# EAGLE design Q_Control (EAGLE 6.3)
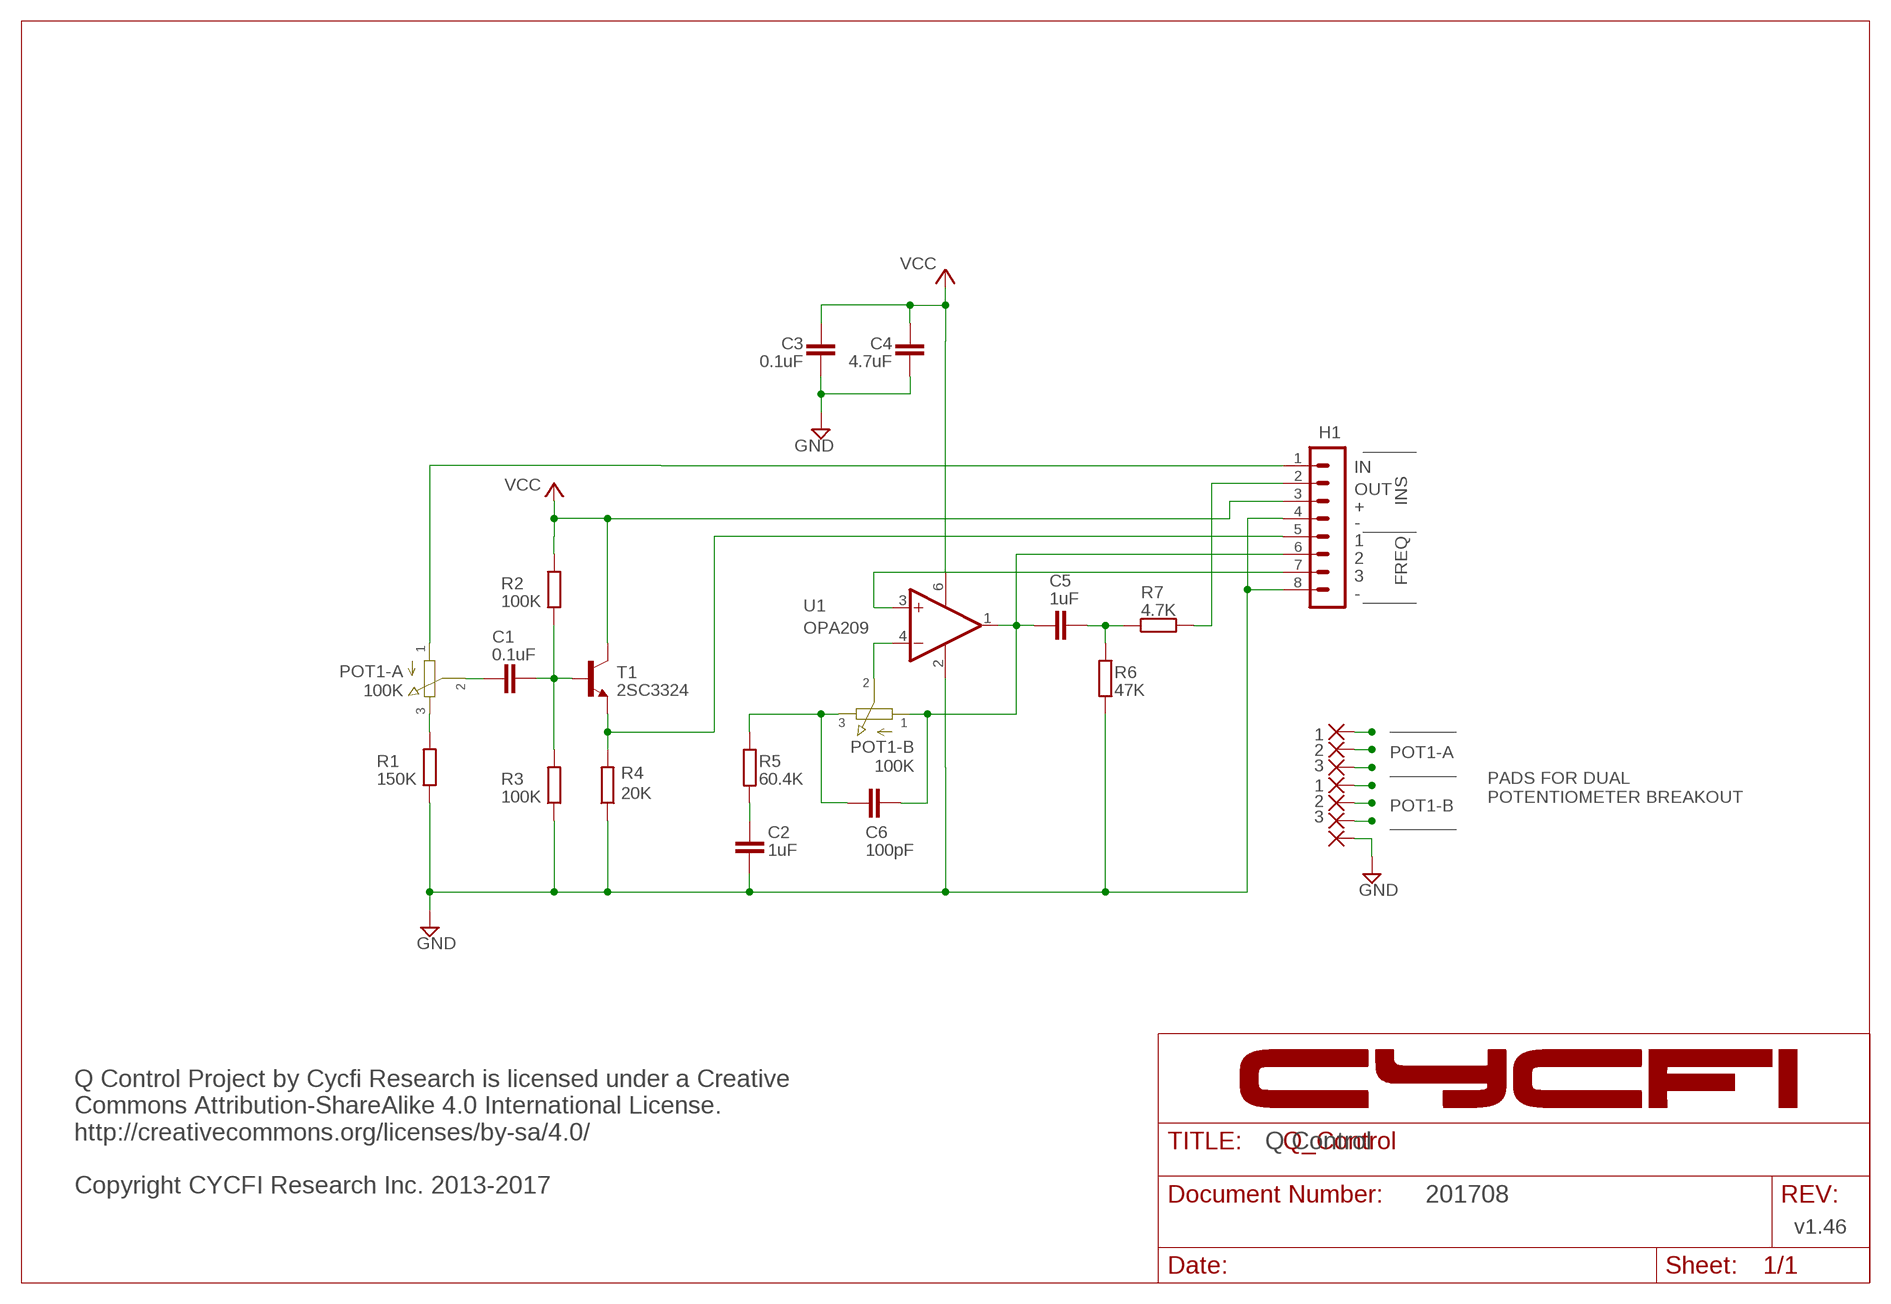
[diagram p0: schematic, sheet 1]

## Parts
C1  0.1uF  C-EUC0603  [C0603]
C2  1uF  C-EUC0805  [C0805]
C3  0.1uF  C-EUC0603  [C0603]
C4  4.7uF  C-EUC0603  [C0603]
C5  1uF  C-EUC0805  [C0805]
C6  100pF  C-EUC0805  [C0805]
H1  MA08-1  [MA08-1]
PAD1  SMD2  [SMD1,27-2,54]
PAD2  SMD2  [SMD1,27-2,54]
PAD3  SMD2  [SMD1,27-2,54]
PAD4  SMD2  [SMD1,27-2,54]
PAD5  SMD2  [SMD1,27-2,54]
PAD6  SMD2  [SMD1,27-2,54]
PAD7  SMD2  [SMD1,27-2,54]
R1  150K  R-EU_R0402  [R0402]
R2  100K  R-EU_R0402  [R0402]
R3  100K  R-EU_R0402  [R0402]
R4  20K  R-EU_R0402  [R0402]
R5  60.4K  R-EU_R0402  [R0402]
R6  47K  R-EU_R0402  [R0402]
R7  4.7K  R-EU_R0402  [R0402]
T1  2SC3324  BC846  [SOT23]
U1  OPA209  OPA836  [SOT23-6]

## Nets
1: H1.5 R4.2 T1.2(E)
3: H1.7 U1.3(+IN)
ASDADS: C5.1 R6.2 R7.1
BYP: H1.1 PAD1.1(P)
EQ: H1.2 R7.2
GND: C2.1 C3.1 C4.1 H1.4 H1.8 PAD7.1(P) R1.1 R3.1 R4.1 R6.1 U1.2(V-)
INPUT: C1.1 PAD2.1(P)
N$4: C1.2 R2.1 R3.2 T1.1(B)
N$8: C2.2 R5.2
PA-3: PAD3.1(P) R1.2
PTB-1: C5.2 C6.2 H1.6 PAD5.1(P) U1.1(OUT)
PTB-2: PAD6.1(P) U1.4(-IN)
PTB-3: C6.1 PAD4.1(P) R5.1
VIN: C3.2 C4.2 H1.3 R2.2 T1.3(C) U1.6(V+) ; supply symbol labelled VCC

## Notes on the sheet
- IN
- OUT
- + | INS
- -
- 1
- 2
- 3
- - | FREQ
- 1
- POT1-A
  100K
- 2
- 2
- 3
- 3 | 1
- 1
- 2 | POT1-A
- POT1-B
  100K
- 3
- 1
- PADS FOR DUAL 
  POTENTIOMETER BREAKOUT
- 2 | POT1-B
- 3
- Q Control
- Q Control Project by Cycfi Research is licensed under a Creative
  Commons Attribution-ShareAlike 4.0 International License. 
  http://creativecommons.org/licenses/by-sa/4.0/ 
  
  Copyright CYCFI Research Inc. 2013-2017
- 201708
- v1.46

## Library data of the parts
C1-C6 = resistor:C-EU: CAPACITOR, European symbol
H1 = con-lstb:MA08-1: PIN HEADER; OC_FARNELL: unknown; OC_NEWARK: unknown
PAD1-PAD7 = wirepad:SMD2: SMD PAD
R1-R7 = resistor:R-EU_: RESISTOR, European symbol
T1 = transistor:BC846: NPN TRANSISTOR
U1 = CYCFI:OPA836: OPA836 Single amplifier

## Board
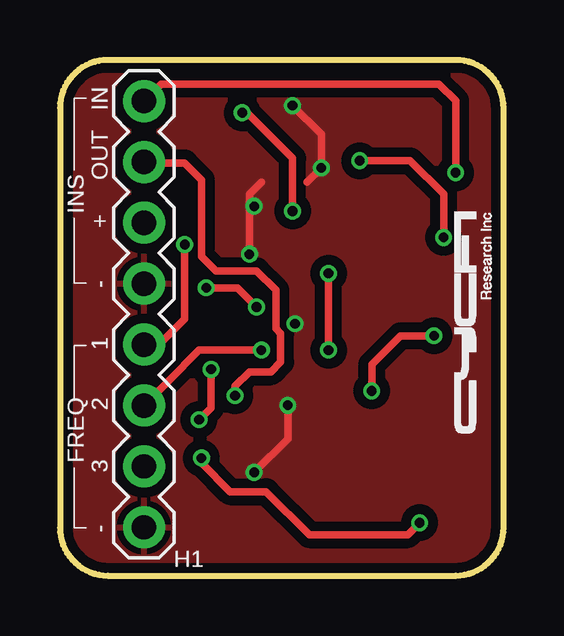
[diagram p1: board, top side]
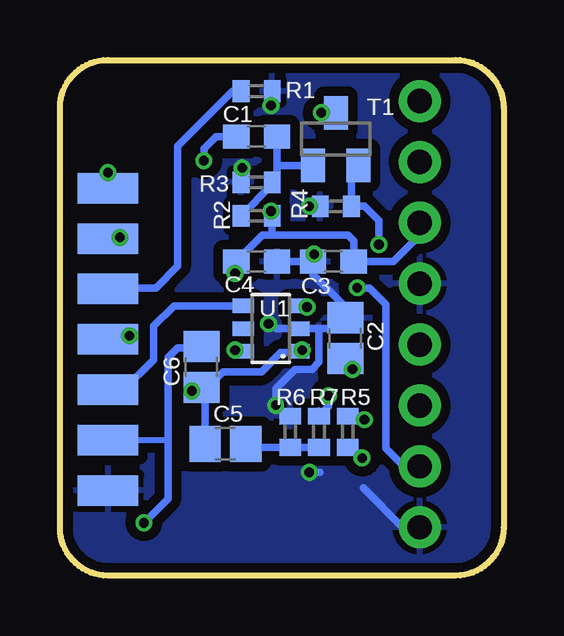
[diagram p2: board, bottom side, seen from below]

Size 18.5 x 21.5 mm. Coordinates in mm from the lower left corner, seen from the top.
Outline: 2,0 16.5,0 arc90 18.5,2 18.5,19.5 arc90 16.5,21.5 2,21.5 arc90 0,19.5 0,2 arc90 2,0
Copper layers (1*16): Top 0.035mm / dielectric 1.5mm / Bottom 0.035mm
Design rules "Elecrow_2-layer_eagle_rule": minimum track width 6mil, minimum drill 12mil, track to track 6mil, track to pad 6mil, pad to pad 6mil, via to via 6mil, smd to smd 0mil, copper to edge 10mil, drill to drill 10mil, minimum pad ring 10mil, minimum via ring 6mil, stop-mask expansion 2mil, vias tented up to drill 100mil, thermal gap 10mil

### Footprints (pad centres in the part's own frame; a part is rotated, then mirrored left to right if it is on the bottom)
C0603 = smd 1.1 x 1: 1 -0.85,0; 2 0.85,0
C0805 = smd 1.3 x 1.5: 1 -0.85,0; 2 0.85,0
MA08-1 = drill 1.016 pad 1.75: 1 -8.89,0; 2 -6.35,0; 3 -3.81,0; 4 -1.27,0; 5 1.27,0; 6 3.81,0; 7 6.35,0; 8 8.89,0
SMD1,27-2,54 = smd 1.27 x 2.54: 1 0,0
R0402 = smd 0.7 x 0.9: 1 -0.65,0; 2 0.65,0
SOT23 = smd 1 x 1.4: 1 -0.95,-1.1; 2 0.95,-1.1; 3 0,1.1
SOT23-6 = smd 0.9 x 0.6: 1 -1.15,0.95; 2 -1.15,0; 3 -1.15,-0.95; 4 1.15,-0.95; 5 1.15,0; 6 1.15,0.95

### Placement (x,y rotation side)
C1  10.3,18.3 0 bottom
C2  6.6,9.9 270 bottom
C3  7.1,13.1 0 bottom
C4  10.3,13.1 180 bottom
C5  11.6,5.5 180 bottom
C6  12.6,8.7 270 bottom
H1  3.5,10.9 270 top
PAD1  16.5,16.15 90 bottom
PAD2  16.5,14.05 90 bottom
PAD3  16.5,11.95 90 bottom
PAD4  16.5,5.65 90 bottom
PAD5  16.5,9.85 90 bottom
PAD6  16.5,7.75 90 bottom
PAD7  16.5,3.55 270 bottom
R1  10.3,20.2 180 bottom
R2  10.3,15 0 bottom
R3  10.3,16.4 0 bottom
R4  7,15.4 0 bottom
R5  6.5,6 90 bottom
R6  8.9,6 270 bottom
R7  7.7,6 90 bottom
T1  7,18.2 0 bottom
U1  9.7,10.3 180 bottom

### Tracks (layer width: path | path; a pad name or v marks a point on that pad's centre or on a via)
1  (via drill 0.4)
  Top 0.305: v5.2,13.8 5.2,10.7 4.1,9.6 3.53,9.6 H1.5
  Bottom 0.305: 5.8,17.35 T1.2 6.35,16.8 R4.2 5.8,15.4 5.2,14.8 v5.2,13.8
3  (via drill 0.4)
  Top 0.305: v6.1,12 7.4,12 v8.2,11.2
  Bottom 0.305: U1.3 8.45,11.25 v8.2,11.2 | v6.1,12 5.6,12 4.9,11.3 4.9,5.3 4.2,4.6 3.55,4.6 H1.7
ASDADS
  Bottom 0.305: R7.1 R6.2 10.6,5.35 C5.1
BYP  (via drill 0.4)
  Top 0.305: H1.1 4.21,20.5 15.8,20.5 16.5,19.8 v16.5,16.8
  Bottom 0.406: v16.5,16.8 PAD1.1
EQ  (via drill 0.4)
  Top 0.305: v7.3,7.5 7.3,7.9 7.9,8.5 8.8,8.5 9.2,8.9 9.2,10.1 9,10.3 9,11.9 8.2,12.7 6.5,12.7 5.9,13.3 5.9,16.5 5.2,17.2 3.55,17.2 H1.2
  Bottom 0.254: R7.2 7.7,6.9
  Bottom 0.305: v7.3,7.5 7.3,7.05 R7.2
GND  (via drill 0.4)
  Top 0.305: v9.5,7.1 9.5,5.7 v8.1,4.3 | 8.4,16.4 7.9,15.9 7.9,15.4 | 10.3,16.4 v10.9,17 10.9,18.4 v9.7,19.6 | v7.9,13.4 7.9,15.4 | v8.1,15.4 7.9,15.4
  Bottom 0.305: C3.1 C4.1 | C3.1 7.95,12.55 6.7,11.3 6.7,10.85 C2.1 | 7.7,10.3 U1.2 9.5,10.3 9.8,10.6 v9.8,10.5 | 7.7,10.3 7.05,10.3 C2.1 | 5.85,3.65 4.2,2 H1.8 | R6.1 9.05,6.65 v9.5,7.1 9.5,7.8 8.7,8.6 8,8.6 7.7,8.9 7.7,10.3 | v8.1,4.3 7.65,4.3 | H1.4 3.63,12.17 | 6.55,10.8 C2.1 | C3.1 7.95,13.55 v7.9,13.4 | v10.9,17 10.9,16.45 R3.1 | R4.1 v8.1,15.4 | v9.7,19.6 9.7,20.15 R1.1
  pour Top (isolate 0.406): 2,0 16.5,0 arc90 18.5,2 18.5,19.5 arc90 16.5,21.5 2,21.5 arc90 0,19.5 0,2 arc90
  pour Bottom (isolate 0.406): 2,0 16.5,0 arc90 18.5,2 18.5,19.5 arc90 16.5,21.5 2,21.5 arc90 0,19.5 0,2 arc90
INPUT  (via drill 0.4)
  Top 0.305: v12.5,17.3 14.6,17.3 16,15.9 v16,14.1
  Bottom 0.305: v12.5,17.3 12.5,17.8 12,18.3 C1.1 | v16,14.1 16.45,14.1
  Bottom 0.406: PAD2.1 16,14.05 v16,14.1
N$4
  Bottom 0.305: C1.2 9.45,17 | 9.45,17 9.45,16.6 R3.2 9.65,16.3 R2.1 | T1.1 9.35,17.1 9.45,17
N$8  (via drill 0.4)
  Top 0.305: v6.3,8.6 6.3,7 v5.8,6.5
  Bottom 0.305: v6.3,8.6 6.55,9 C2.2 | R5.2 5.95,6.65 v5.8,6.5
PA-3
  Bottom 0.305: R1.2 11.3,20.2 13.6,17.9 13.6,12.9 14.5,12 16.45,12
  Bottom 0.406: PAD3.1 16.45,11.95 16.45,12
PTB-1  (via drill 0.4)
  Top 0.305: v8.4,9.4 5.8,9.4 4.5,8.1 4.5,8.09 H1.6 | v13,7.7 13,8.8 14.2,10 v15.6,10
  Bottom 0.305: v8.4,9.4 8.45,9.35 U1.1 8.6,9.3 9.3,9.3 10.1,8.5 11.7,8.5 12.45,7.75 12.45,7.6 | C5.2 12.45,7.6 | 12.45,7.6 C6.2 12.85,7.85 v13,7.7
  Bottom 0.406: PAD5.1 15.6,9.85 v15.6,10
PTB-2
  Bottom 0.305: U1.4 13.75,11.25 14.6,10.4 14.6,9 15.9,7.7 16.45,7.7
  Bottom 0.406: PAD6.1 16.45,7.75 16.45,7.7
PTB-3  (via drill 0.4)
  Top 0.305: v15,2.2 14.5,1.7 10.4,1.7 8.6,3.5 7.1,3.5 5.9,4.7 v5.9,4.9
  Bottom 0.254: PAD4.1 14.05,5.65
  Bottom 0.305: 14,5.6 14,9.1 13.6,9.5 12.75,9.5 C6.1 | 14.05,5.65 14,5.6 | R5.1 6.35,5.35 v5.9,4.9 | 14,5.6 14,3.2 v15,2.2
VIN  (via drill 0.4)
  Top 0.305: v11.2,9.4 v11.2,12.6 | v9.7,15.2 9.7,17.4 7.8,19.3 v7.6,19.3
  Bottom 0.305: 9.6,14.2 6.5,14.2 6.25,13.95 C3.2 4.6,13.1 3.5,14.2 H1.3 | 9.6,14.2 10.05,14.2 C4.2 11.2,13.05 v11.2,12.6 | 9.6,14.2 9.65,14.25 R2.2 9.65,14.95 v9.7,15.2 | U1.6 11.15,9.35 v11.2,9.4 | v7.6,19.3 T1.3

### Text on the board
tNames: IN | OUT | INS | + | - | 1 | 2 | FREQ | 3 | -
_tNames: IN | OUT | INS | + | - | 1 | 2 | FREQ | 3 | - | H1
_bNames: R1 | T1 | C1 | R3 | R4 | R2 | C3 | C4 | C2 | U1 | C6 | R5 | R7 | R6 | C5